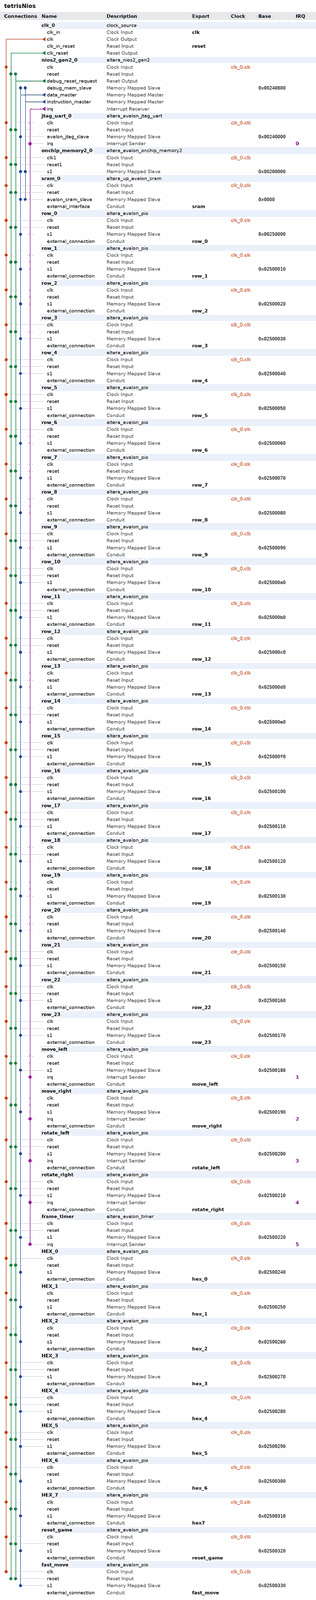
[diagram p0: system contents, whole]
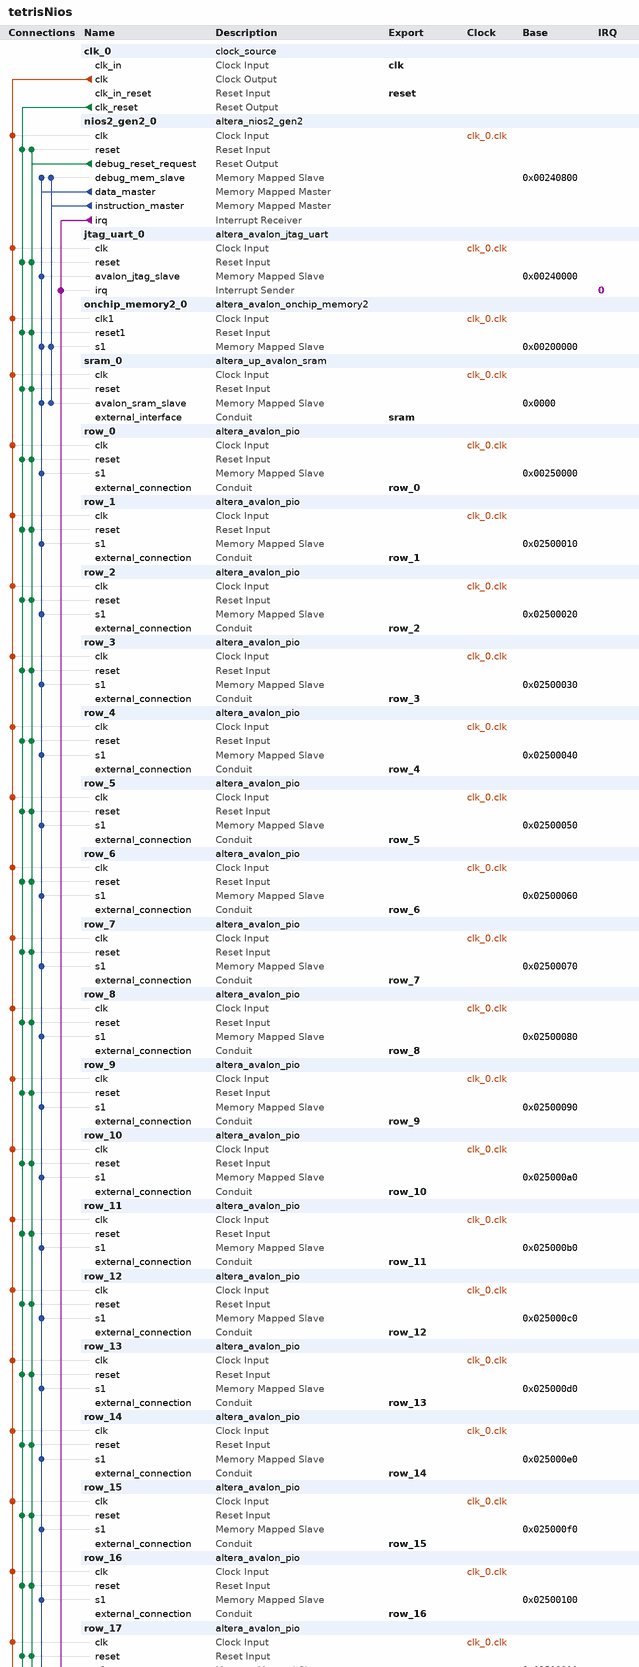
[diagram p1: system contents, upper part]
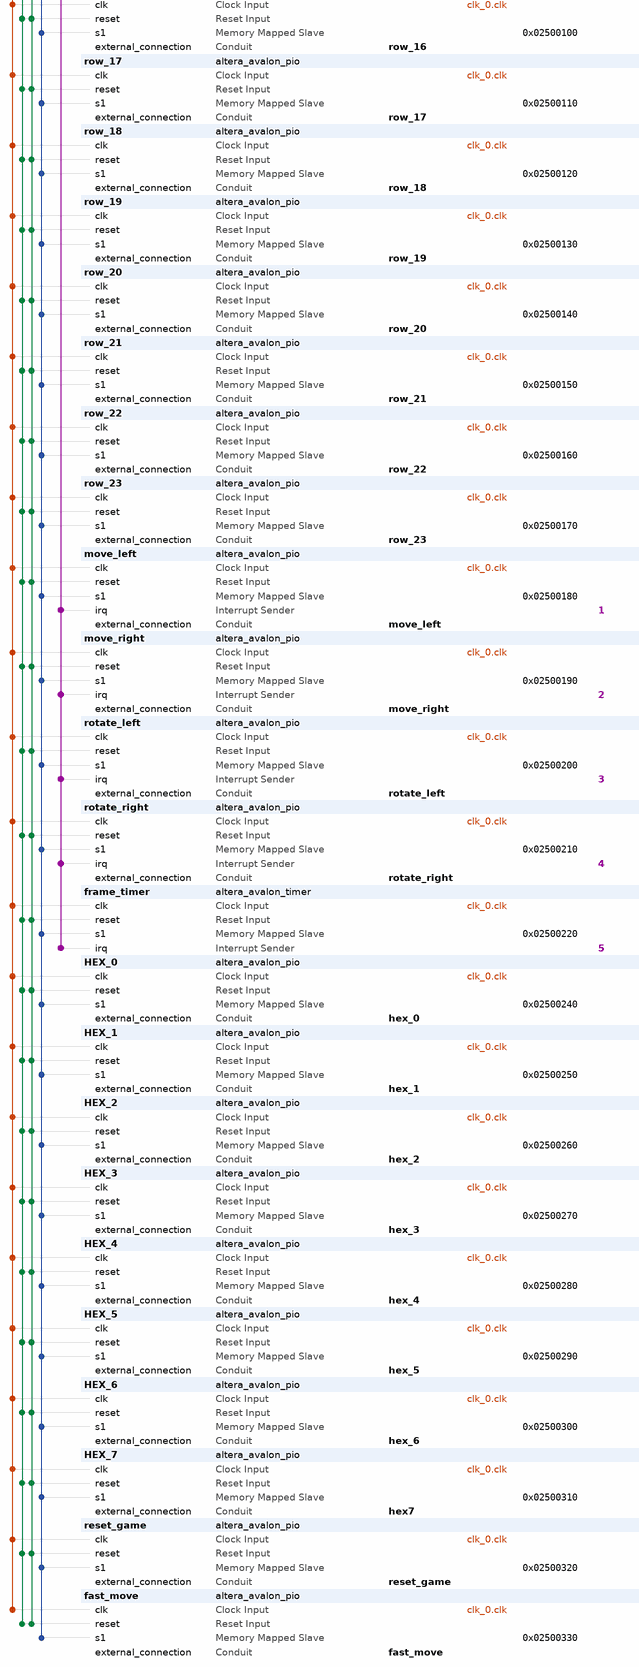
[diagram p2: system contents, lower part]
# Platform Designer (Qsys) system tetrisNios, Cyclone IV E EP4CE115F29C7
# Parameters at their usual value, and those the tool derives, are not listed.
package require -exact qsys 18.1
create_system tetrisNios
set_project_property DEVICE_FAMILY {Cyclone IV E}
set_project_property DEVICE EP4CE115F29C7

add_instance clk_0 clock_source 18.1
set_instance_parameter_value clk_0 clockFrequency 50000000

add_instance nios2_gen2_0 altera_nios2_gen2 18.1
set_instance_parameter_value nios2_gen2_0 dcache_size 2048
set_instance_parameter_value nios2_gen2_0 exceptionSlave onchip_memory2_0.s1
set_instance_parameter_value nios2_gen2_0 icache_size 4096
set_instance_parameter_value nios2_gen2_0 impl Tiny
set_instance_parameter_value nios2_gen2_0 resetSlave onchip_memory2_0.s1

add_instance jtag_uart_0 altera_avalon_jtag_uart 18.1
set_instance_parameter_value jtag_uart_0 simInteractiveOptions NO_INTERACTIVE_WINDOWS

add_instance onchip_memory2_0 altera_avalon_onchip_memory2 18.1
set_instance_parameter_value onchip_memory2_0 dataWidth 16
set_instance_parameter_value onchip_memory2_0 dualPort false
set_instance_parameter_value onchip_memory2_0 initMemContent true
set_instance_parameter_value onchip_memory2_0 initializationFileName onchip_mem.hex
set_instance_parameter_value onchip_memory2_0 memorySize 200096

add_instance sram_0 altera_up_avalon_sram 18.0
set_instance_parameter_value sram_0 board DE2-115
set_instance_parameter_value sram_0 pixel_buffer false

add_instance row_0 altera_avalon_pio 18.1
set_instance_parameter_value row_0 direction Output
set_instance_parameter_value row_0 width 30

add_instance row_1 altera_avalon_pio 18.1
set_instance_parameter_value row_1 direction Output
set_instance_parameter_value row_1 width 30

add_instance row_2 altera_avalon_pio 18.1
set_instance_parameter_value row_2 direction Output
set_instance_parameter_value row_2 width 30

add_instance row_3 altera_avalon_pio 18.1
set_instance_parameter_value row_3 direction Output
set_instance_parameter_value row_3 width 30

add_instance row_4 altera_avalon_pio 18.1
set_instance_parameter_value row_4 direction Output
set_instance_parameter_value row_4 width 30

add_instance row_5 altera_avalon_pio 18.1
set_instance_parameter_value row_5 direction Output
set_instance_parameter_value row_5 width 30

add_instance row_6 altera_avalon_pio 18.1
set_instance_parameter_value row_6 direction Output
set_instance_parameter_value row_6 width 30

add_instance row_7 altera_avalon_pio 18.1
set_instance_parameter_value row_7 direction Output
set_instance_parameter_value row_7 width 30

add_instance row_8 altera_avalon_pio 18.1
set_instance_parameter_value row_8 direction Output
set_instance_parameter_value row_8 width 30

add_instance row_9 altera_avalon_pio 18.1
set_instance_parameter_value row_9 direction Output
set_instance_parameter_value row_9 width 30

add_instance row_10 altera_avalon_pio 18.1
set_instance_parameter_value row_10 direction Output
set_instance_parameter_value row_10 width 30

add_instance row_11 altera_avalon_pio 18.1
set_instance_parameter_value row_11 direction Output
set_instance_parameter_value row_11 width 30

add_instance row_12 altera_avalon_pio 18.1
set_instance_parameter_value row_12 direction Output
set_instance_parameter_value row_12 width 30

add_instance row_13 altera_avalon_pio 18.1
set_instance_parameter_value row_13 direction Output
set_instance_parameter_value row_13 width 30

add_instance row_14 altera_avalon_pio 18.1
set_instance_parameter_value row_14 direction Output
set_instance_parameter_value row_14 width 30

add_instance row_15 altera_avalon_pio 18.1
set_instance_parameter_value row_15 direction Output
set_instance_parameter_value row_15 width 30

add_instance row_16 altera_avalon_pio 18.1
set_instance_parameter_value row_16 direction Output
set_instance_parameter_value row_16 width 30

add_instance row_17 altera_avalon_pio 18.1
set_instance_parameter_value row_17 direction Output
set_instance_parameter_value row_17 width 30

add_instance row_18 altera_avalon_pio 18.1
set_instance_parameter_value row_18 direction Output
set_instance_parameter_value row_18 width 30

add_instance row_19 altera_avalon_pio 18.1
set_instance_parameter_value row_19 direction Output
set_instance_parameter_value row_19 width 30

add_instance row_20 altera_avalon_pio 18.1
set_instance_parameter_value row_20 direction Output
set_instance_parameter_value row_20 width 30

add_instance row_21 altera_avalon_pio 18.1
set_instance_parameter_value row_21 direction Output
set_instance_parameter_value row_21 width 30

add_instance row_22 altera_avalon_pio 18.1
set_instance_parameter_value row_22 direction Output
set_instance_parameter_value row_22 width 30

add_instance row_23 altera_avalon_pio 18.1
set_instance_parameter_value row_23 direction Output
set_instance_parameter_value row_23 width 30

add_instance move_left altera_avalon_pio 18.1
set_instance_parameter_value move_left captureEdge true
set_instance_parameter_value move_left direction Input
set_instance_parameter_value move_left edgeType FALLING
set_instance_parameter_value move_left generateIRQ true
set_instance_parameter_value move_left irqType EDGE
set_instance_parameter_value move_left width 1

add_instance move_right altera_avalon_pio 18.1
set_instance_parameter_value move_right captureEdge true
set_instance_parameter_value move_right direction Input
set_instance_parameter_value move_right edgeType FALLING
set_instance_parameter_value move_right generateIRQ true
set_instance_parameter_value move_right irqType EDGE
set_instance_parameter_value move_right width 1

add_instance rotate_left altera_avalon_pio 18.1
set_instance_parameter_value rotate_left captureEdge true
set_instance_parameter_value rotate_left direction Input
set_instance_parameter_value rotate_left edgeType FALLING
set_instance_parameter_value rotate_left generateIRQ true
set_instance_parameter_value rotate_left irqType EDGE
set_instance_parameter_value rotate_left width 1

add_instance rotate_right altera_avalon_pio 18.1
set_instance_parameter_value rotate_right captureEdge true
set_instance_parameter_value rotate_right direction Input
set_instance_parameter_value rotate_right edgeType FALLING
set_instance_parameter_value rotate_right generateIRQ true
set_instance_parameter_value rotate_right irqType EDGE
set_instance_parameter_value rotate_right width 1

add_instance frame_timer altera_avalon_timer 18.1
set_instance_parameter_value frame_timer period 16.7
set_instance_parameter_value frame_timer periodUnits MSEC

add_instance HEX_0 altera_avalon_pio 18.1
set_instance_parameter_value HEX_0 direction Output
set_instance_parameter_value HEX_0 width 7

add_instance HEX_1 altera_avalon_pio 18.1
set_instance_parameter_value HEX_1 direction Output
set_instance_parameter_value HEX_1 width 7

add_instance HEX_2 altera_avalon_pio 18.1
set_instance_parameter_value HEX_2 direction Output
set_instance_parameter_value HEX_2 width 7

add_instance HEX_3 altera_avalon_pio 18.1
set_instance_parameter_value HEX_3 direction Output
set_instance_parameter_value HEX_3 width 7

add_instance HEX_4 altera_avalon_pio 18.1
set_instance_parameter_value HEX_4 direction Output
set_instance_parameter_value HEX_4 width 7

add_instance HEX_5 altera_avalon_pio 18.1
set_instance_parameter_value HEX_5 direction Output
set_instance_parameter_value HEX_5 width 7

add_instance HEX_6 altera_avalon_pio 18.1
set_instance_parameter_value HEX_6 direction Output
set_instance_parameter_value HEX_6 width 7

add_instance HEX_7 altera_avalon_pio 18.1
set_instance_parameter_value HEX_7 direction Output
set_instance_parameter_value HEX_7 width 7

add_instance reset_game altera_avalon_pio 18.1
set_instance_parameter_value reset_game direction Input
set_instance_parameter_value reset_game width 1

add_instance fast_move altera_avalon_pio 18.1
set_instance_parameter_value fast_move direction Input
set_instance_parameter_value fast_move width 1

# connections
add_connection clk_0.clk fast_move.clk clock
add_connection clk_0.clk frame_timer.clk clock
add_connection clk_0.clk HEX_0.clk clock
add_connection clk_0.clk HEX_1.clk clock
add_connection clk_0.clk HEX_2.clk clock
add_connection clk_0.clk HEX_3.clk clock
add_connection clk_0.clk HEX_4.clk clock
add_connection clk_0.clk HEX_5.clk clock
add_connection clk_0.clk HEX_6.clk clock
add_connection clk_0.clk HEX_7.clk clock
add_connection clk_0.clk jtag_uart_0.clk clock
add_connection clk_0.clk move_left.clk clock
add_connection clk_0.clk move_right.clk clock
add_connection clk_0.clk nios2_gen2_0.clk clock
add_connection clk_0.clk onchip_memory2_0.clk1 clock
add_connection clk_0.clk reset_game.clk clock
add_connection clk_0.clk rotate_left.clk clock
add_connection clk_0.clk rotate_right.clk clock
add_connection clk_0.clk row_0.clk clock
add_connection clk_0.clk row_1.clk clock
add_connection clk_0.clk row_2.clk clock
add_connection clk_0.clk row_3.clk clock
add_connection clk_0.clk row_4.clk clock
add_connection clk_0.clk row_5.clk clock
add_connection clk_0.clk row_6.clk clock
add_connection clk_0.clk row_7.clk clock
add_connection clk_0.clk row_8.clk clock
add_connection clk_0.clk row_9.clk clock
add_connection clk_0.clk row_10.clk clock
add_connection clk_0.clk row_11.clk clock
add_connection clk_0.clk row_12.clk clock
add_connection clk_0.clk row_13.clk clock
add_connection clk_0.clk row_14.clk clock
add_connection clk_0.clk row_15.clk clock
add_connection clk_0.clk row_16.clk clock
add_connection clk_0.clk row_17.clk clock
add_connection clk_0.clk row_18.clk clock
add_connection clk_0.clk row_19.clk clock
add_connection clk_0.clk row_20.clk clock
add_connection clk_0.clk row_21.clk clock
add_connection clk_0.clk row_22.clk clock
add_connection clk_0.clk row_23.clk clock
add_connection clk_0.clk sram_0.clk clock
add_connection clk_0.clk_reset fast_move.reset reset
add_connection clk_0.clk_reset frame_timer.reset reset
add_connection clk_0.clk_reset HEX_0.reset reset
add_connection clk_0.clk_reset HEX_1.reset reset
add_connection clk_0.clk_reset HEX_2.reset reset
add_connection clk_0.clk_reset HEX_3.reset reset
add_connection clk_0.clk_reset HEX_4.reset reset
add_connection clk_0.clk_reset HEX_5.reset reset
add_connection clk_0.clk_reset HEX_6.reset reset
add_connection clk_0.clk_reset HEX_7.reset reset
add_connection clk_0.clk_reset jtag_uart_0.reset reset
add_connection clk_0.clk_reset move_left.reset reset
add_connection clk_0.clk_reset move_right.reset reset
add_connection clk_0.clk_reset nios2_gen2_0.reset reset
add_connection clk_0.clk_reset onchip_memory2_0.reset1 reset
add_connection clk_0.clk_reset reset_game.reset reset
add_connection clk_0.clk_reset rotate_left.reset reset
add_connection clk_0.clk_reset rotate_right.reset reset
add_connection clk_0.clk_reset row_0.reset reset
add_connection clk_0.clk_reset row_1.reset reset
add_connection clk_0.clk_reset row_2.reset reset
add_connection clk_0.clk_reset row_3.reset reset
add_connection clk_0.clk_reset row_4.reset reset
add_connection clk_0.clk_reset row_5.reset reset
add_connection clk_0.clk_reset row_6.reset reset
add_connection clk_0.clk_reset row_7.reset reset
add_connection clk_0.clk_reset row_8.reset reset
add_connection clk_0.clk_reset row_9.reset reset
add_connection clk_0.clk_reset row_10.reset reset
add_connection clk_0.clk_reset row_11.reset reset
add_connection clk_0.clk_reset row_12.reset reset
add_connection clk_0.clk_reset row_13.reset reset
add_connection clk_0.clk_reset row_14.reset reset
add_connection clk_0.clk_reset row_15.reset reset
add_connection clk_0.clk_reset row_16.reset reset
add_connection clk_0.clk_reset row_17.reset reset
add_connection clk_0.clk_reset row_18.reset reset
add_connection clk_0.clk_reset row_19.reset reset
add_connection clk_0.clk_reset row_20.reset reset
add_connection clk_0.clk_reset row_21.reset reset
add_connection clk_0.clk_reset row_22.reset reset
add_connection clk_0.clk_reset row_23.reset reset
add_connection clk_0.clk_reset sram_0.reset reset
add_connection nios2_gen2_0.debug_reset_request fast_move.reset reset
add_connection nios2_gen2_0.debug_reset_request frame_timer.reset reset
add_connection nios2_gen2_0.debug_reset_request HEX_0.reset reset
add_connection nios2_gen2_0.debug_reset_request HEX_1.reset reset
add_connection nios2_gen2_0.debug_reset_request HEX_2.reset reset
add_connection nios2_gen2_0.debug_reset_request HEX_3.reset reset
add_connection nios2_gen2_0.debug_reset_request HEX_4.reset reset
add_connection nios2_gen2_0.debug_reset_request HEX_5.reset reset
add_connection nios2_gen2_0.debug_reset_request HEX_6.reset reset
add_connection nios2_gen2_0.debug_reset_request HEX_7.reset reset
add_connection nios2_gen2_0.debug_reset_request jtag_uart_0.reset reset
add_connection nios2_gen2_0.debug_reset_request move_left.reset reset
add_connection nios2_gen2_0.debug_reset_request move_right.reset reset
add_connection nios2_gen2_0.debug_reset_request nios2_gen2_0.reset reset
add_connection nios2_gen2_0.debug_reset_request onchip_memory2_0.reset1 reset
add_connection nios2_gen2_0.debug_reset_request reset_game.reset reset
add_connection nios2_gen2_0.debug_reset_request rotate_left.reset reset
add_connection nios2_gen2_0.debug_reset_request rotate_right.reset reset
add_connection nios2_gen2_0.debug_reset_request row_0.reset reset
add_connection nios2_gen2_0.debug_reset_request row_1.reset reset
add_connection nios2_gen2_0.debug_reset_request row_2.reset reset
add_connection nios2_gen2_0.debug_reset_request row_3.reset reset
add_connection nios2_gen2_0.debug_reset_request row_4.reset reset
add_connection nios2_gen2_0.debug_reset_request row_5.reset reset
add_connection nios2_gen2_0.debug_reset_request row_6.reset reset
add_connection nios2_gen2_0.debug_reset_request row_7.reset reset
add_connection nios2_gen2_0.debug_reset_request row_8.reset reset
add_connection nios2_gen2_0.debug_reset_request row_9.reset reset
add_connection nios2_gen2_0.debug_reset_request row_10.reset reset
add_connection nios2_gen2_0.debug_reset_request row_11.reset reset
add_connection nios2_gen2_0.debug_reset_request row_12.reset reset
add_connection nios2_gen2_0.debug_reset_request row_13.reset reset
add_connection nios2_gen2_0.debug_reset_request row_14.reset reset
add_connection nios2_gen2_0.debug_reset_request row_15.reset reset
add_connection nios2_gen2_0.debug_reset_request row_16.reset reset
add_connection nios2_gen2_0.debug_reset_request row_17.reset reset
add_connection nios2_gen2_0.debug_reset_request row_18.reset reset
add_connection nios2_gen2_0.debug_reset_request row_19.reset reset
add_connection nios2_gen2_0.debug_reset_request row_20.reset reset
add_connection nios2_gen2_0.debug_reset_request row_21.reset reset
add_connection nios2_gen2_0.debug_reset_request row_22.reset reset
add_connection nios2_gen2_0.debug_reset_request row_23.reset reset
add_connection nios2_gen2_0.debug_reset_request sram_0.reset reset
add_connection nios2_gen2_0.data_master fast_move.s1 avalon
set_connection_parameter_value nios2_gen2_0.data_master/fast_move.s1 baseAddress 0x02500330
add_connection nios2_gen2_0.data_master frame_timer.s1 avalon
set_connection_parameter_value nios2_gen2_0.data_master/frame_timer.s1 baseAddress 0x02500220
add_connection nios2_gen2_0.data_master HEX_0.s1 avalon
set_connection_parameter_value nios2_gen2_0.data_master/HEX_0.s1 baseAddress 0x02500240
add_connection nios2_gen2_0.data_master HEX_1.s1 avalon
set_connection_parameter_value nios2_gen2_0.data_master/HEX_1.s1 baseAddress 0x02500250
add_connection nios2_gen2_0.data_master HEX_2.s1 avalon
set_connection_parameter_value nios2_gen2_0.data_master/HEX_2.s1 baseAddress 0x02500260
add_connection nios2_gen2_0.data_master HEX_3.s1 avalon
set_connection_parameter_value nios2_gen2_0.data_master/HEX_3.s1 baseAddress 0x02500270
add_connection nios2_gen2_0.data_master HEX_4.s1 avalon
set_connection_parameter_value nios2_gen2_0.data_master/HEX_4.s1 baseAddress 0x02500280
add_connection nios2_gen2_0.data_master HEX_5.s1 avalon
set_connection_parameter_value nios2_gen2_0.data_master/HEX_5.s1 baseAddress 0x02500290
add_connection nios2_gen2_0.data_master HEX_6.s1 avalon
set_connection_parameter_value nios2_gen2_0.data_master/HEX_6.s1 baseAddress 0x02500300
add_connection nios2_gen2_0.data_master HEX_7.s1 avalon
set_connection_parameter_value nios2_gen2_0.data_master/HEX_7.s1 baseAddress 0x02500310
add_connection nios2_gen2_0.data_master jtag_uart_0.avalon_jtag_slave avalon
set_connection_parameter_value nios2_gen2_0.data_master/jtag_uart_0.avalon_jtag_slave baseAddress 0x00240000
add_connection nios2_gen2_0.data_master move_left.s1 avalon
set_connection_parameter_value nios2_gen2_0.data_master/move_left.s1 baseAddress 0x02500180
add_connection nios2_gen2_0.data_master move_right.s1 avalon
set_connection_parameter_value nios2_gen2_0.data_master/move_right.s1 baseAddress 0x02500190
add_connection nios2_gen2_0.data_master nios2_gen2_0.debug_mem_slave avalon
set_connection_parameter_value nios2_gen2_0.data_master/nios2_gen2_0.debug_mem_slave baseAddress 0x00240800
add_connection nios2_gen2_0.data_master onchip_memory2_0.s1 avalon
set_connection_parameter_value nios2_gen2_0.data_master/onchip_memory2_0.s1 baseAddress 0x00200000
add_connection nios2_gen2_0.data_master reset_game.s1 avalon
set_connection_parameter_value nios2_gen2_0.data_master/reset_game.s1 baseAddress 0x02500320
add_connection nios2_gen2_0.data_master rotate_left.s1 avalon
set_connection_parameter_value nios2_gen2_0.data_master/rotate_left.s1 baseAddress 0x02500200
add_connection nios2_gen2_0.data_master rotate_right.s1 avalon
set_connection_parameter_value nios2_gen2_0.data_master/rotate_right.s1 baseAddress 0x02500210
add_connection nios2_gen2_0.data_master row_0.s1 avalon
set_connection_parameter_value nios2_gen2_0.data_master/row_0.s1 baseAddress 0x00250000
add_connection nios2_gen2_0.data_master row_1.s1 avalon
set_connection_parameter_value nios2_gen2_0.data_master/row_1.s1 baseAddress 0x02500010
add_connection nios2_gen2_0.data_master row_2.s1 avalon
set_connection_parameter_value nios2_gen2_0.data_master/row_2.s1 baseAddress 0x02500020
add_connection nios2_gen2_0.data_master row_3.s1 avalon
set_connection_parameter_value nios2_gen2_0.data_master/row_3.s1 baseAddress 0x02500030
add_connection nios2_gen2_0.data_master row_4.s1 avalon
set_connection_parameter_value nios2_gen2_0.data_master/row_4.s1 baseAddress 0x02500040
add_connection nios2_gen2_0.data_master row_5.s1 avalon
set_connection_parameter_value nios2_gen2_0.data_master/row_5.s1 baseAddress 0x02500050
add_connection nios2_gen2_0.data_master row_6.s1 avalon
set_connection_parameter_value nios2_gen2_0.data_master/row_6.s1 baseAddress 0x02500060
add_connection nios2_gen2_0.data_master row_7.s1 avalon
set_connection_parameter_value nios2_gen2_0.data_master/row_7.s1 baseAddress 0x02500070
add_connection nios2_gen2_0.data_master row_8.s1 avalon
set_connection_parameter_value nios2_gen2_0.data_master/row_8.s1 baseAddress 0x02500080
add_connection nios2_gen2_0.data_master row_9.s1 avalon
set_connection_parameter_value nios2_gen2_0.data_master/row_9.s1 baseAddress 0x02500090
add_connection nios2_gen2_0.data_master row_10.s1 avalon
set_connection_parameter_value nios2_gen2_0.data_master/row_10.s1 baseAddress 0x025000a0
add_connection nios2_gen2_0.data_master row_11.s1 avalon
set_connection_parameter_value nios2_gen2_0.data_master/row_11.s1 baseAddress 0x025000b0
add_connection nios2_gen2_0.data_master row_12.s1 avalon
set_connection_parameter_value nios2_gen2_0.data_master/row_12.s1 baseAddress 0x025000c0
add_connection nios2_gen2_0.data_master row_13.s1 avalon
set_connection_parameter_value nios2_gen2_0.data_master/row_13.s1 baseAddress 0x025000d0
add_connection nios2_gen2_0.data_master row_14.s1 avalon
set_connection_parameter_value nios2_gen2_0.data_master/row_14.s1 baseAddress 0x025000e0
add_connection nios2_gen2_0.data_master row_15.s1 avalon
set_connection_parameter_value nios2_gen2_0.data_master/row_15.s1 baseAddress 0x025000f0
add_connection nios2_gen2_0.data_master row_16.s1 avalon
set_connection_parameter_value nios2_gen2_0.data_master/row_16.s1 baseAddress 0x02500100
add_connection nios2_gen2_0.data_master row_17.s1 avalon
set_connection_parameter_value nios2_gen2_0.data_master/row_17.s1 baseAddress 0x02500110
add_connection nios2_gen2_0.data_master row_18.s1 avalon
set_connection_parameter_value nios2_gen2_0.data_master/row_18.s1 baseAddress 0x02500120
add_connection nios2_gen2_0.data_master row_19.s1 avalon
set_connection_parameter_value nios2_gen2_0.data_master/row_19.s1 baseAddress 0x02500130
add_connection nios2_gen2_0.data_master row_20.s1 avalon
set_connection_parameter_value nios2_gen2_0.data_master/row_20.s1 baseAddress 0x02500140
add_connection nios2_gen2_0.data_master row_21.s1 avalon
set_connection_parameter_value nios2_gen2_0.data_master/row_21.s1 baseAddress 0x02500150
add_connection nios2_gen2_0.data_master row_22.s1 avalon
set_connection_parameter_value nios2_gen2_0.data_master/row_22.s1 baseAddress 0x02500160
add_connection nios2_gen2_0.data_master row_23.s1 avalon
set_connection_parameter_value nios2_gen2_0.data_master/row_23.s1 baseAddress 0x02500170
add_connection nios2_gen2_0.data_master sram_0.avalon_sram_slave avalon
set_connection_parameter_value nios2_gen2_0.data_master/sram_0.avalon_sram_slave baseAddress 0x0000
add_connection nios2_gen2_0.instruction_master nios2_gen2_0.debug_mem_slave avalon
set_connection_parameter_value nios2_gen2_0.instruction_master/nios2_gen2_0.debug_mem_slave baseAddress 0x00240800
add_connection nios2_gen2_0.instruction_master onchip_memory2_0.s1 avalon
set_connection_parameter_value nios2_gen2_0.instruction_master/onchip_memory2_0.s1 baseAddress 0x00200000
add_connection nios2_gen2_0.instruction_master sram_0.avalon_sram_slave avalon
set_connection_parameter_value nios2_gen2_0.instruction_master/sram_0.avalon_sram_slave baseAddress 0x0000
add_connection nios2_gen2_0.irq frame_timer.irq interrupt
set_connection_parameter_value nios2_gen2_0.irq/frame_timer.irq irqNumber 5
add_connection nios2_gen2_0.irq jtag_uart_0.irq interrupt
set_connection_parameter_value nios2_gen2_0.irq/jtag_uart_0.irq irqNumber 0
add_connection nios2_gen2_0.irq move_left.irq interrupt
set_connection_parameter_value nios2_gen2_0.irq/move_left.irq irqNumber 1
add_connection nios2_gen2_0.irq move_right.irq interrupt
set_connection_parameter_value nios2_gen2_0.irq/move_right.irq irqNumber 2
add_connection nios2_gen2_0.irq rotate_left.irq interrupt
set_connection_parameter_value nios2_gen2_0.irq/rotate_left.irq irqNumber 3
add_connection nios2_gen2_0.irq rotate_right.irq interrupt
set_connection_parameter_value nios2_gen2_0.irq/rotate_right.irq irqNumber 4

# exported interfaces
add_interface clk clock sink
set_interface_property clk EXPORT_OF clk_0.clk_in
add_interface fast_move conduit end
set_interface_property fast_move EXPORT_OF fast_move.external_connection
add_interface hex7 conduit end
set_interface_property hex7 EXPORT_OF HEX_7.external_connection
add_interface hex_0 conduit end
set_interface_property hex_0 EXPORT_OF HEX_0.external_connection
add_interface hex_1 conduit end
set_interface_property hex_1 EXPORT_OF HEX_1.external_connection
add_interface hex_2 conduit end
set_interface_property hex_2 EXPORT_OF HEX_2.external_connection
add_interface hex_3 conduit end
set_interface_property hex_3 EXPORT_OF HEX_3.external_connection
add_interface hex_4 conduit end
set_interface_property hex_4 EXPORT_OF HEX_4.external_connection
add_interface hex_5 conduit end
set_interface_property hex_5 EXPORT_OF HEX_5.external_connection
add_interface hex_6 conduit end
set_interface_property hex_6 EXPORT_OF HEX_6.external_connection
add_interface move_left conduit end
set_interface_property move_left EXPORT_OF move_left.external_connection
add_interface move_right conduit end
set_interface_property move_right EXPORT_OF move_right.external_connection
add_interface reset reset sink
set_interface_property reset EXPORT_OF clk_0.clk_in_reset
add_interface reset_game conduit end
set_interface_property reset_game EXPORT_OF reset_game.external_connection
add_interface rotate_left conduit end
set_interface_property rotate_left EXPORT_OF rotate_left.external_connection
add_interface rotate_right conduit end
set_interface_property rotate_right EXPORT_OF rotate_right.external_connection
add_interface row_0 conduit end
set_interface_property row_0 EXPORT_OF row_0.external_connection
add_interface row_1 conduit end
set_interface_property row_1 EXPORT_OF row_1.external_connection
add_interface row_10 conduit end
set_interface_property row_10 EXPORT_OF row_10.external_connection
add_interface row_11 conduit end
set_interface_property row_11 EXPORT_OF row_11.external_connection
add_interface row_12 conduit end
set_interface_property row_12 EXPORT_OF row_12.external_connection
add_interface row_13 conduit end
set_interface_property row_13 EXPORT_OF row_13.external_connection
add_interface row_14 conduit end
set_interface_property row_14 EXPORT_OF row_14.external_connection
add_interface row_15 conduit end
set_interface_property row_15 EXPORT_OF row_15.external_connection
add_interface row_16 conduit end
set_interface_property row_16 EXPORT_OF row_16.external_connection
add_interface row_17 conduit end
set_interface_property row_17 EXPORT_OF row_17.external_connection
add_interface row_18 conduit end
set_interface_property row_18 EXPORT_OF row_18.external_connection
add_interface row_19 conduit end
set_interface_property row_19 EXPORT_OF row_19.external_connection
add_interface row_2 conduit end
set_interface_property row_2 EXPORT_OF row_2.external_connection
add_interface row_20 conduit end
set_interface_property row_20 EXPORT_OF row_20.external_connection
add_interface row_21 conduit end
set_interface_property row_21 EXPORT_OF row_21.external_connection
add_interface row_22 conduit end
set_interface_property row_22 EXPORT_OF row_22.external_connection
add_interface row_23 conduit end
set_interface_property row_23 EXPORT_OF row_23.external_connection
add_interface row_3 conduit end
set_interface_property row_3 EXPORT_OF row_3.external_connection
add_interface row_4 conduit end
set_interface_property row_4 EXPORT_OF row_4.external_connection
add_interface row_5 conduit end
set_interface_property row_5 EXPORT_OF row_5.external_connection
add_interface row_6 conduit end
set_interface_property row_6 EXPORT_OF row_6.external_connection
add_interface row_7 conduit end
set_interface_property row_7 EXPORT_OF row_7.external_connection
add_interface row_8 conduit end
set_interface_property row_8 EXPORT_OF row_8.external_connection
add_interface row_9 conduit end
set_interface_property row_9 EXPORT_OF row_9.external_connection
add_interface sram conduit end
set_interface_property sram EXPORT_OF sram_0.external_interface

set_interconnect_requirement {$system} qsys_mm.clockCrossingAdapter HANDSHAKE
set_interconnect_requirement {$system} qsys_mm.enableEccProtection FALSE
set_interconnect_requirement {$system} qsys_mm.insertDefaultSlave FALSE
set_interconnect_requirement {$system} qsys_mm.maxAdditionalLatency 1

save_system tetrisNios.qsys
